# EAGLE design powermeterV2 (EAGLE 9.5.0)

## Sheet 1 of 3
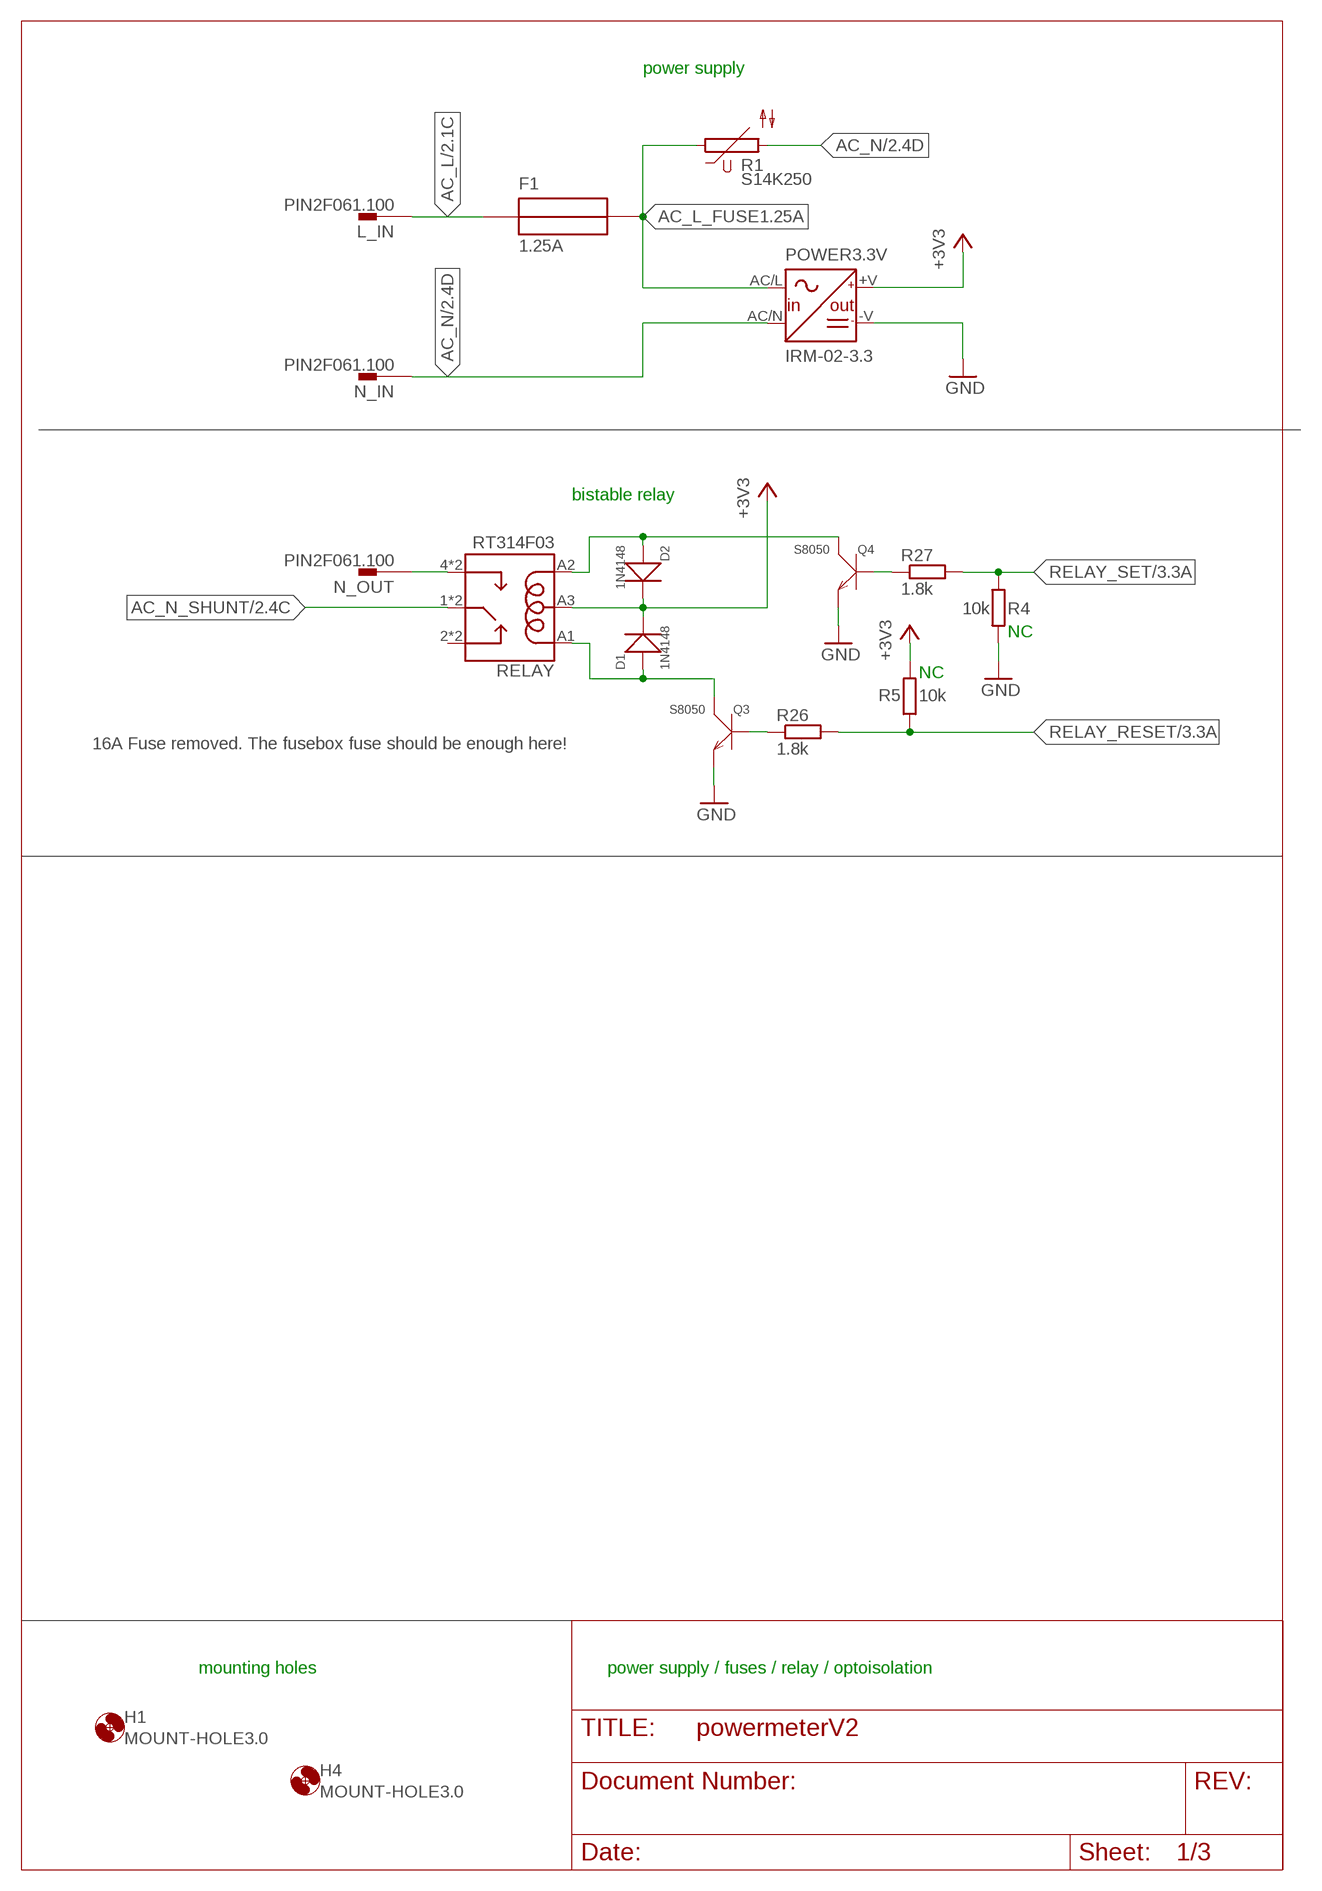
[diagram p0: schematic, sheet 1]

### Parts
D1  1N4148  SMD-DIODE-SWITCH-1N4148(LL-34)  [LL-34]
D2  1N4148  SMD-DIODE-SWITCH-1N4148(LL-34)  [LL-34]
F1  1.25A  UMT250  [SMD_FUSE]
H1  MOUNT-HOLE3.0  [3,0]
H4  MOUNT-HOLE3.0  [3,0]
L_IN  PIN2F061.100  [F061.100]
N_IN  PIN2F061.100  [F061.100]
N_OUT  PIN2F061.100  [F061.100]
POWER3.3V  IRM-02-3.3  [MW_IRM-02]
Q3  S8050  SMD-TRANSISTORS-NPN-25V-500MW-S8050(SOT-23)  [SOT-23]
Q4  S8050  SMD-TRANSISTORS-NPN-25V-500MW-S8050(SOT-23)  [SOT-23]
R1  S14K250  [S14K250]
R4  10k  R-EU_R0402  [R0402]
R5  10k  R-EU_R0402  [R0402]
R26  1.8k  R-EU_R0402  [R0402]
R27  1.8k  R-EU_R0402  [R0402]
RELAY  RT314F03  [RELAY_RT314F03]

### Nets
+3V3: D1.C(-) D2.C(-) POWER3.3V.+V(+V_OUT) R5.2 RELAY.A3 ; also sheet 2,3
AC_L: F1.P$1 L_IN.A1 L_IN.A2 ; also sheet 2
AC_L_FUSE1.25A: F1.P$2 POWER3.3V.AC/L(L) R1.1
AC_N: N_IN.A1 N_IN.A2 POWER3.3V.AC/N(N) R1.2 ; also sheet 2
AC_N_SHUNT: RELAY.1 RELAY.11 ; also sheet 2
GND: POWER3.3V.-V(-V_OUT) Q3.2(E) Q4.2(E) R4.2 ; also sheet 2,3
N$4: N_OUT.A1 N_OUT.A2 RELAY.4 RELAY.14
N$12: Q3.1(B) R26.1
N$17: D1.A(+) Q3.3(C) RELAY.A1
N$27: Q4.1(B) R27.1
N$28: D2.A(+) Q4.3(C) RELAY.A2
RELAY_RESET: R5.1 R26.2 ; also sheet 3
RELAY_SET: R4.1 R27.2 ; also sheet 3
Unconnected: RELAY.2 RELAY.12

### Notes on the sheet
- power supply
- bistable relay
- NC
- NC
- 16A Fuse removed. The fusebox fuse should be enough here!
- mounting holes | power supply / fuses / relay / optoisolation

## Sheet 2 of 3
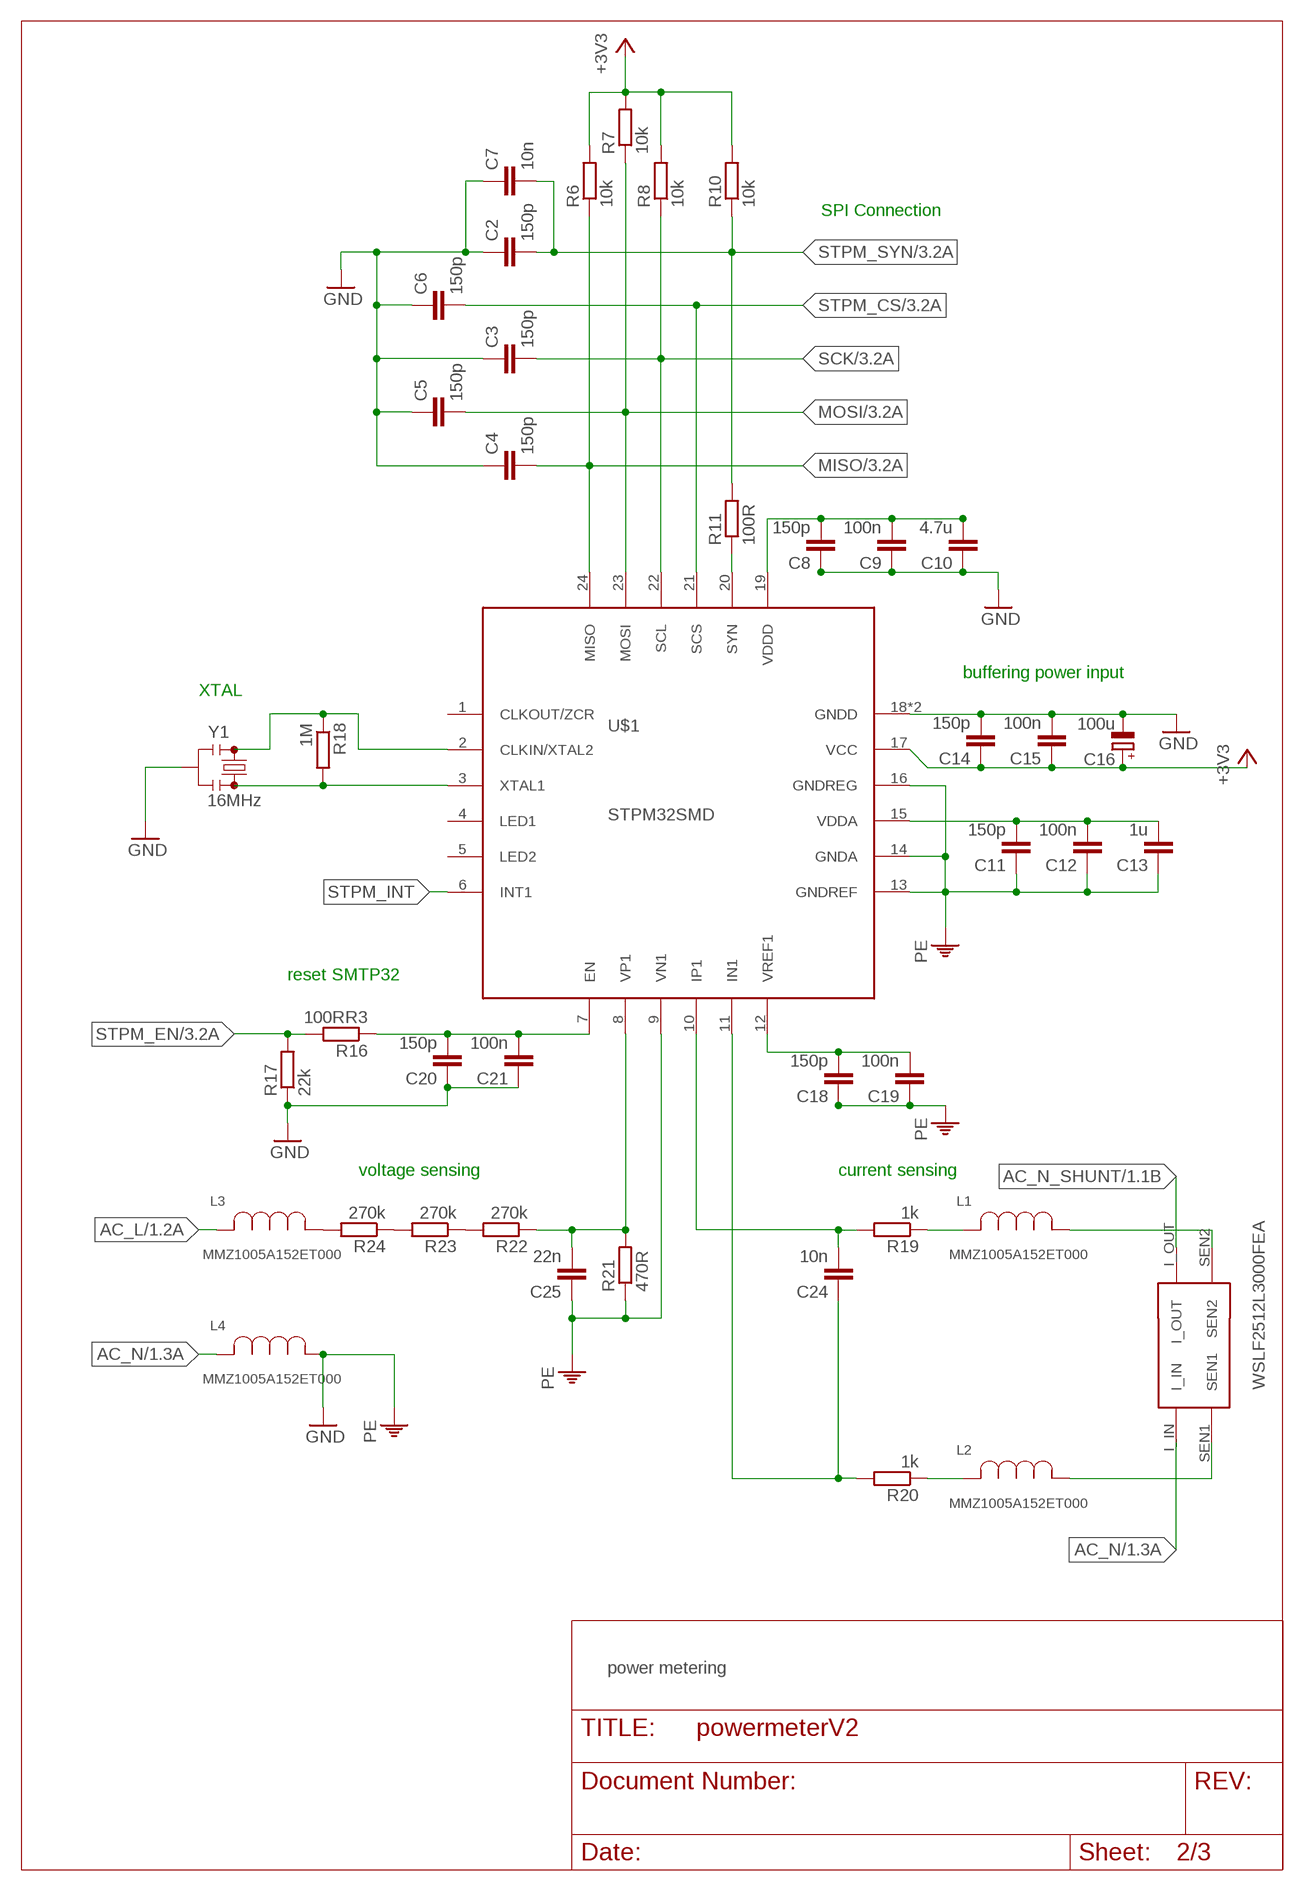
[diagram p1: schematic, sheet 2]

### Parts
C2  150p  C-EUC0402  [C0402]
C3  150p  C-EUC0402  [C0402]
C4  150p  C-EUC0402  [C0402]
C5  150p  C-EUC0402  [C0402]
C6  150p  C-EUC0402  [C0402]
C7  10n  C-EUC0603  [C0603]
C8  150p  C-EUC0402  [C0402]
C9  100n  C-EUC0603  [C0603]
C10  4.7u  C-EUC0805  [C0805]
C11  150p  C-EUC0402  [C0402]
C12  100n  C-EUC0603  [C0603]
C13  1u  C-EUC0603  [C0603]
C14  150p  C-EUC0402  [C0402]
C15  100n  C-EUC0603  [C0603]
C16  100u  CPOL-EUD/7343-31W  [D/7343-31W]
C18  150p  C-EUC0402  [C0402]
C19  100n  C-EUC0603  [C0603]
C20  150p  C-EUC0402  [C0402]
C21  100n  C-EUC0603  [C0603]
C24  10n  C-EUC0603  [C0603]
C25  22n  C-EUC0603  [C0603]
L1  MMZ1005A152ET000  [IND_1005]
L2  MMZ1005A152ET000  [IND_1005]
L3  MMZ1005A152ET000  [IND_1005]
L4  MMZ1005A152ET000  [IND_1005]
R6  10k  R-EU_R0603  [R0603]
R7  10k  R-EU_R0603  [R0603]
R8  10k  R-EU_R0603  [R0603]
R10  10k  R-EU_R0603  [R0603]
R11  100R  R-EU_R0603  [R0603]
R16  100RR3  R-EU_R0603  [R0603]
R17  22k  R-EU_R0603  [R0603]
R18  1M  R-EU_R0603  [R0603]
R19  1k  R-EU_R0603  [R0603]
R20  1k  R-EU_R0603  [R0603]
R21  470R  R-EU_M1206  [M1206]
R22  270k  R-EU_M1206  [M1206]
R23  270k  R-EU_M1206  [M1206]
R24  270k  R-EU_M1206  [M1206]
SHUNT  WSLF2512L3000FEA  [SMD_SHUNT]
U$1  STPM32SMD  [QFN24]
Y1  16MHz  RESONATORSMD-3.2X1.3  [RESONATOR-SMD-3.2X1.3]

### Nets
+3V3: C14.1 C15.1 C16.+ R6.2 R7.2 R8.2 R10.2 U$1.17(VCC) ; also sheet 1,3
AC_L: L3.2 ; also sheet 1
AC_N: L4.2 SHUNT.I_IN ; also sheet 1
AC_N_SHUNT: SHUNT.I_OUT ; also sheet 1
DC_GND1: C18.2 C19.2 U$1.12(VREF1)
DC_GND2: C20.2 C21.2 R16.1 U$1.7(EN)
GND: C2.1 C3.1 C4.1 C5.1 C6.1 C7.1 C8.1 C9.1 C10.1 C11.1 C12.1 C13.1 C14.2 C15.2 C16.- C18.1 C19.1 C20.1 C21.1 C25.1 L4.1 R17.1 R21.1 U$1.9(VN1) U$1.13(GNDREF) U$1.14(GNDA) U$1.16(GNDREG) U$1.18(GNDD) U$1.EXP(GNDD) Y1.2 ; supply symbol labelled PE ; also sheet 1,3
MISO: C4.2 R6.1 U$1.24(MISO) ; also sheet 3
MOSI: C5.2 R7.1 U$1.23(MOSI) ; also sheet 3
N$3: C8.2 C9.2 C10.2 U$1.19(VDDD)
N$6: C11.2 C12.2 C13.2 U$1.15(VDDA)
N$7: R18.2 U$1.3(XTAL1) Y1.3
N$8: R18.1 U$1.2(CLKIN/XTAL2) Y1.1
N$9: C24.1 R20.2 U$1.11(IN1)
N$10: R11.1 U$1.20(SYN)
N$11: C24.2 R19.2 U$1.10(IP1)
N$13: C25.2 R21.2 R22.1 U$1.8(VP1)
N$14: R23.2 R24.1
N$15: R22.2 R23.1
N$19: L3.1 R24.2
N$21: L1.2 R19.1
N$22: L2.2 R20.1
N$24: L1.1 SHUNT.SEN2
N$25: L2.1 SHUNT.SEN1
SCK: C3.2 R8.1 U$1.22(SCL) ; also sheet 3
STPM_CS: C6.2 U$1.21(SCS) ; also sheet 3
STPM_EN: R16.2 R17.2 ; also sheet 3
STPM_INT: U$1.6(INT1)
STPM_SYN: C2.2 C7.2 R10.1 R11.2 ; also sheet 3
Unconnected: U$1.1(CLKOUT/ZCR) U$1.4(LED1) U$1.5(LED2)

### Notes on the sheet
- SPI Connection
- buffering power input
- XTAL
- reset SMTP32
- voltage sensing | current sensing
- power metering

## Sheet 3 of 3
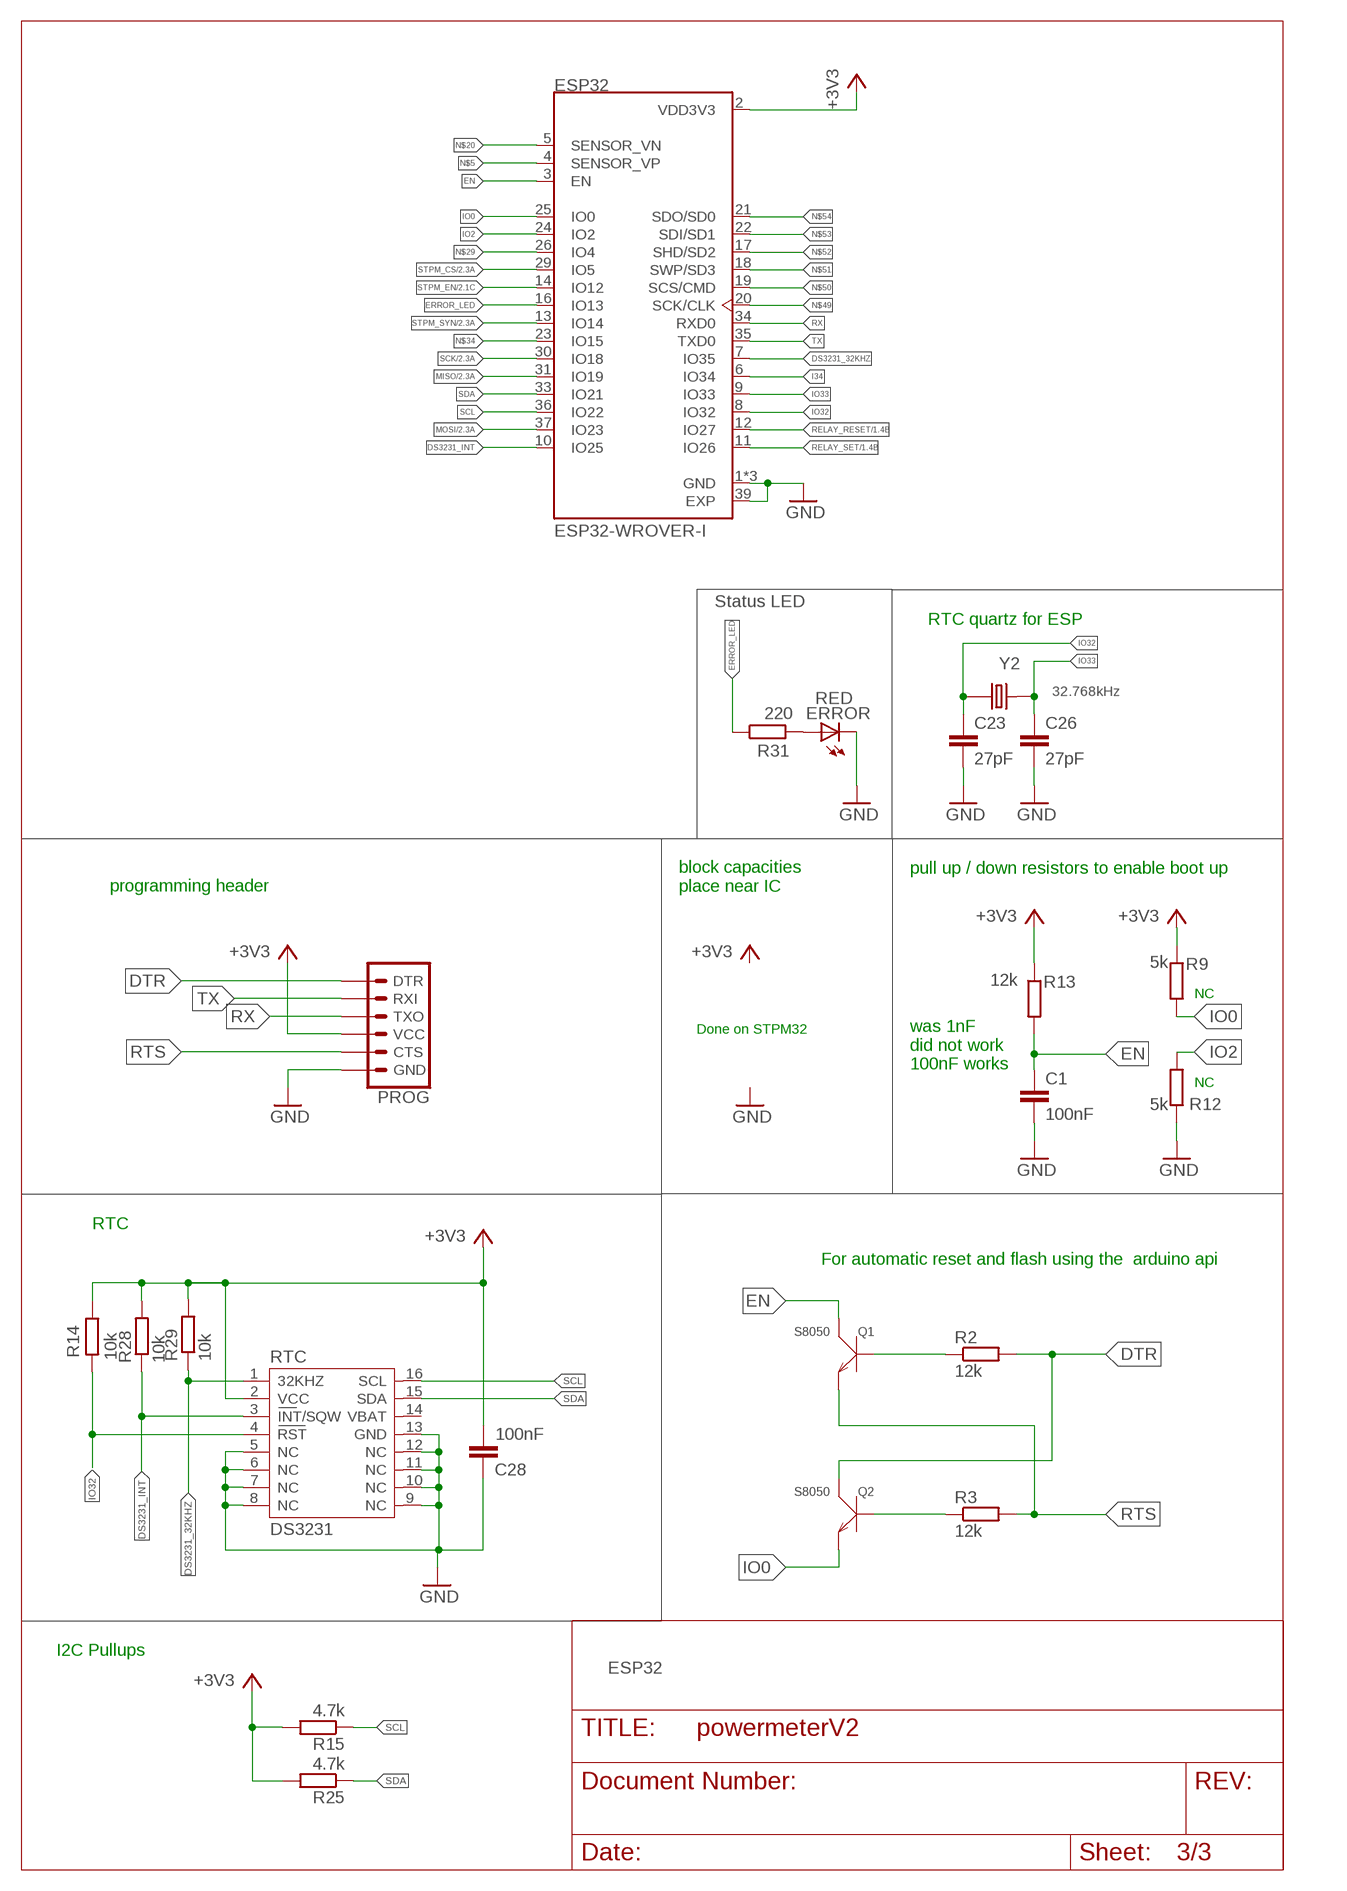
[diagram p2: schematic, sheet 3]

### Parts
C1  100nF  C-EUC0402  [C0402]
C23  27pF  C-EUC0402  [C0402]
C26  27pF  C-EUC0402  [C0402]
C28  100nF  C-EUC0402  [C0402]
ERROR  RED  LEDCHIP-LED0805  [CHIP-LED0805]
ESP32  ESP32-WROVER-I  [XCVR_ESP32-WROVER-I]
PROG  6_PIN_SERIAL_TARGET  [1X06]
Q1  S8050  SMD-TRANSISTORS-NPN-25V-500MW-S8050(SOT-23)  [SOT-23]
Q2  S8050  SMD-TRANSISTORS-NPN-25V-500MW-S8050(SOT-23)  [SOT-23]
R2  12k  R-EU_R0402  [R0402]
R3  12k  R-EU_R0402  [R0402]
R9  5k  R-EU_R0402  [R0402]
R12  5k  R-EU_R0402  [R0402]
R13  12k  R-EU_R0402  [R0402]
R14  10k  R-EU_R0603  [R0603]
R15  4.7k  R-EU_R0603  [R0603]
R25  4.7k  R-EU_R0603  [R0603]
R28  10k  R-EU_R0603  [R0603]
R29  10k  R-EU_R0603  [R0603]
R31  220  R-EU_R0603  [R0603]
RTC  DS3231  [DS3231]
Y2  NX2012SA-32.768K-STD-MUB-1  [XTAL_NX2012SA-32.768K-STD-MUB-1]

### Nets
+3V3: C28.2 ESP32.2(VDD3V3) PROG.4(VCC) R9.1 R13.1 R14.1 R15.2 R25.2 R28.2 R29.2 RTC.2(VCC) ; also sheet 1,2
DS3231_32KHZ: ESP32.7(IO35) R29.1 RTC.1(32KHZ)
DS3231_INT: ESP32.10(IO25) R28.1 RTC.3(INT/SQW)
DTR: PROG.1(DTR) Q2.3(C) R2.2
EN: C1.1 ESP32.3(EN) Q1.3(C) R13.2
ERROR_LED: ESP32.16(IO13) R31.1
GND: C1.2 C23.2 C26.2 C28.1 ERROR.C ESP32.1(GND) ESP32.15(GND) ESP32.38(GND) ESP32.39(EXP) PROG.6(GND) R12.1 RTC.5(NC) RTC.6(NC) RTC.7(NC) RTC.8(NC) RTC.9(NC) RTC.10(NC) RTC.11(NC) RTC.12(NC) RTC.13(GND) ; also sheet 1,2
I34: ESP32.6(IO34)
IO0: ESP32.25(IO0) Q2.2(E) R9.2
IO2: ESP32.24(IO2) R12.2
IO32: C23.1 ESP32.8(IO32) R14.2 RTC.4(RST) Y2.1
IO33: C26.1 ESP32.9(IO33) Y2.2
MISO: ESP32.31(IO19) ; also sheet 2
MOSI: ESP32.37(IO23) ; also sheet 2
N$1: Q1.1(B) R2.1
N$2: Q2.1(B) R3.1
N$5: ESP32.4(SENSOR_VP)
N$16: ERROR.A R31.2
N$20: ESP32.5(SENSOR_VN)
N$29: ESP32.26(IO4)
N$34: ESP32.23(IO15)
N$49: ESP32.20(SCK/CLK)
N$50: ESP32.19(SCS/CMD)
N$51: ESP32.18(SWP/SD3)
N$52: ESP32.17(SHD/SD2)
N$53: ESP32.22(SDI/SD1)
N$54: ESP32.21(SDO/SD0)
RELAY_RESET: ESP32.12(IO27) ; also sheet 1
RELAY_SET: ESP32.11(IO26) ; also sheet 1
RTS: PROG.5(CTS) Q1.2(E) R3.2
RX: ESP32.34(RXD0) PROG.3(TXO)
SCK: ESP32.30(IO18) ; also sheet 2
SCL: ESP32.36(IO22) R15.1 RTC.16(SCL)
SDA: ESP32.33(IO21) R25.1 RTC.15(SDA)
STPM_CS: ESP32.29(IO5) ; also sheet 2
STPM_EN: ESP32.14(IO12) ; also sheet 2
STPM_SYN: ESP32.13(IO14) ; also sheet 2
TX: ESP32.35(TXD0) PROG.2(RXI)
Unconnected: RTC.14(VBAT)

### Notes on the sheet
- Status LED
- RTC quartz for ESP
- 32.768kHz
- pull up / down resistors to enable boot up
- programming header
- block capacities
  place near IC
- NC
- Done on STPM32
- was 1nF
  did not work
  100nF works
- NC
- RTC
- For automatic reset and flash using the  arduino api
- I2C Pullups
- ESP32

## Library data of the parts
C1-C15 C18-C21 C23-C26 C28 = rcl:C-EU: CAPACITOR, European symbol; SPICEPREFIX: C
C16 = rcl:CPOL-EU: POLARIZED CAPACITOR, European symbol; SPICEPREFIX: C
D1 D2 = Seeed-OPL-Diode:SMD-DIODE-SWITCH-1N4148(LL-34): 304040016; MPN: 1N4148
ERROR = led:LED: LED OSRAM: - CHIPLED LG R971, LG N971, LY N971, LG Q971, LY Q971, LO R971, LY R971 LH N974, LH R974 LS Q976, LO Q976, LY Q976 LO Q996 - Hyper CHIPLED LW Q18S LB Q993, LB Q99A, LB R99A - SideLED LS A670, LO A670, LY A670, LG A670, LP A670 LB A673, LV A673, LT A673, LW A673 LH A674 LY A675 LS A676, LA A676, LO A676, LY A676, LW A676 LS A679, LY A679, LG A679 - Hyper Micro SIDELED® LS Y876, LA Y876, LO Y876, LY Y876 LT Y87S - SmartLED LW L88C, LW L88S LB L89C, LB L89S, LG L890 LS L89K, LO L89K, LY L89K LS L896, LA L896, LO L896, LY L896 - TOPLED LS T670, LO T670, LY T670, LG T670, LP T670 LSG T670, LSP T670, LSY T670, LOP T670, LYG T670 LG T671, LOG T671, LSG T671 LB T673, LV T673, LT T673, LW T673 LH T674 LS T676, LA T676, LO T676, LY T676, LB T676, LH T676, LSB T676, LW T676 LB T67C, LV T67C, LT T67C, LS T67K, LO T67K, LY T67K, LW E67C LS E67B, LA E67B, LO E67B, LY E67B, LB E67C, LV E67C, LT E67C LW T67C LS T679, LY T679, LG T679 LS T770, LO T770, LY T770, LG T770, LP T770 LB T773, LV T773, LT T773, LW T773 LH T774 LS E675, LA E675, LY E675, LS T675 LS T776, LA T776, LO T776, LY T776, LB T776 LHGB T686 LT T68C, LB T68C - Hyper Mini TOPLED® LB M676 - Mini TOPLED Santana® LG M470 LS M47K, LO M47K, LY M47K Source: http://www.osram.convergy.de LUXEON: - LUMILED® LXK2-PW12-R00, LXK2-PW12-S00, LXK2-PW14-U00, LXK2-PW14-V00 LXK2-PM12-R00, LXK2-PM12-S00, LXK2-PM14-U00 LXK2-PE12-Q00, LXK2-PE12-R00, LXK2-PE12-S00, LXK2-PE14-T00, LXK2-PE14-U00 LXK2-PB12-K00, LXK2-PB12-L00, LXK2-PB12-M00, LXK2-PB14-N00, LXK2-PB14-P00, LXK2-PB14-Q00 LXK2-PR12-L00, LXK2-PR12-M00, LXK2-PR14-Q00, LXK2-PR14-R00 LXK2-PD12-Q00, LXK2-PD12-R00, LXK2-PD12-S00 LXK2-PH12-R00, LXK2-PH12-S00 LXK2-PL12-P00, LXK2-PL12-Q00, LXK2-PL12-R00 Source: www.luxeon.com KINGBRIGHT: KA-3528ASYC Source: www.kingbright.com
ESP32 = ESP32-WROVER-I:ESP32-WROVER-I: Module: combo; GPIO, I2C x2, I2S x2, SDIO, SPI x3, UART x3; U.FL; AVAILABILITY: Unavailable; DESCRIPTION: Module: combo; GPIO, I2C x2, I2S x2, SDIO, SPI x3, UART x3; U.FL; MF: Espressif Systems; MP: ESP32-WROVER-I; PACKAGE: Module Espressif Systems; PRICE: None
F1 = _powermeter:UMT250
H1 H4 = holes:MOUNT-HOLE: MOUNTING HOLE with drill center marker
L1-L4 = _powermeter:MMZ1005A152ET000; MANUFACTURER_PART_NUMBER: MMZ1005A152ET000; VENDOR: TDK
L_IN N_IN N_OUT = con-faston:PIN2: Flachstecker Typ Tyco/Electronics/AMP TAB, FASTON Printed Circuit Board Tabs Source: http://www.buerklin.com, http://catalog.tycoelectronics.com; OC_FARNELL: unknown; OC_NEWARK: unknown
POWER3.3V = reichelt_power:IRM-02: MEAN WELL AC/DC Power Modules 2W Soruce: http://meanwellusa.com/productPdf.aspx?i=675; OC_MOUSER: 709-IRM02-3.3
PROG = SparkFun-Connectors:6_PIN_SERIAL_TARGET: 6-pin header connection for use with the "FTDI BASIC" pinout - TARGET SIDE. Also known as "Arduino Serial Program Header". It is used to mate with our FTDI Basic serial programmers using the Arduino IDE. Note, this device has "TARGET" in the name. It is intended to be used on a design that contains a target micro-controller that you wish to program. The "sister" device, named "CABLE" is inteneded to be used on a design that usually lives on the end of your USB cable and prvides the converter chip (FTDI232 or FTDI231x) to commnicate serial RX/TX. You can populate with some of these: Break Away Headers - Straight <https://www.sparkfun.com/products/116> (PRT-00116) For reference (or to suit your programming needs) check out these designs: SparkFun FTDI Basic Breakout - 5V <https://www.sparkfun.com/products/9716> (DEV-09716) SparkFun FTDI Basic Breakout - 3.3V <https://www.sparkfun.com/products/9873> (DEV-09873) SparkFun FTDI SmartBasic <https://www.sparkfun.com/products/12935> (DEV-12935) SparkFun Beefy 3 - FTDI Basic Breakout <https://www.sparkfun.com/products/13746> (DEV-13746)
Q1-Q4 = Seeed-Transistor:SMD-TRANSISTORS-NPN-25V-500MW-S8050(SOT-23): 305010017; MPN: S8050
R1 = varistor:S14K250: VARISTOR
R2-R29 R31 = resistor:R-EU_: RESISTOR, European symbol
RELAY = RT314F03:RT314F03: Electromechanical Relay 3VDC 15Ohm 16A SPDT (( 29mm 12.7mm 15.7mm)) THT Power Relay; AVAILABILITY: Unavailable; DESCRIPTION: Power Relay 3VDC 16A SPDT __ 29mm 12.7mm 15.7mm__ Through Hole; MF: TE Connectivity; MP: RT314F03; PACKAGE: None; PRICE: None; TE_PURCHASE_URL: https://www.te.com/usa-en/product-RT314F03.html?te_bu=Cor&te_type=disp&te_campaign=seda_glo_cor-seda-global-disp-prtnr-fy19-seda-model-bom-cta_sma-317_1&elqCampaignId=32493
RTC = _lh-library:DS3231
SHUNT = _powermeter:WSLF2512L3000FEA
U$1 = _powermeter:STPM32
Y1 = SparkFun-Clocks:RESONATOR: Resonators (Generic) Ceramic resonators are clock-generating components, often used to control timing in microcontrollers. They usually have 3 pins: two pins for oscillation, and one pin for ground. Compared to crystals, resonators have worse tolerance, but are usually much cheaper. Plus, they have built-in load capacitors! These devices are used on boards like the Arduino Pro 8MHz <https://www.sparkfun.com/products/11114> and Arduino Pro 16MHz <https://www.sparkfun.com/products/11113>.
Y2 = NX2012SA-32.768K-STD-MUB-1:NX2012SA-32.768K-STD-MUB-1: Crystal 32.7680khz 12.5pf Smd; AVAILABILITY: Unavailable; DESCRIPTION: Crystal 32.7680khz 12.5pf Smd; MF: NDK America,; MP: NX2012SA-32.768K-STD-MUB-1; PACKAGE: SMD-2 NDK; PRICE: None

## Board
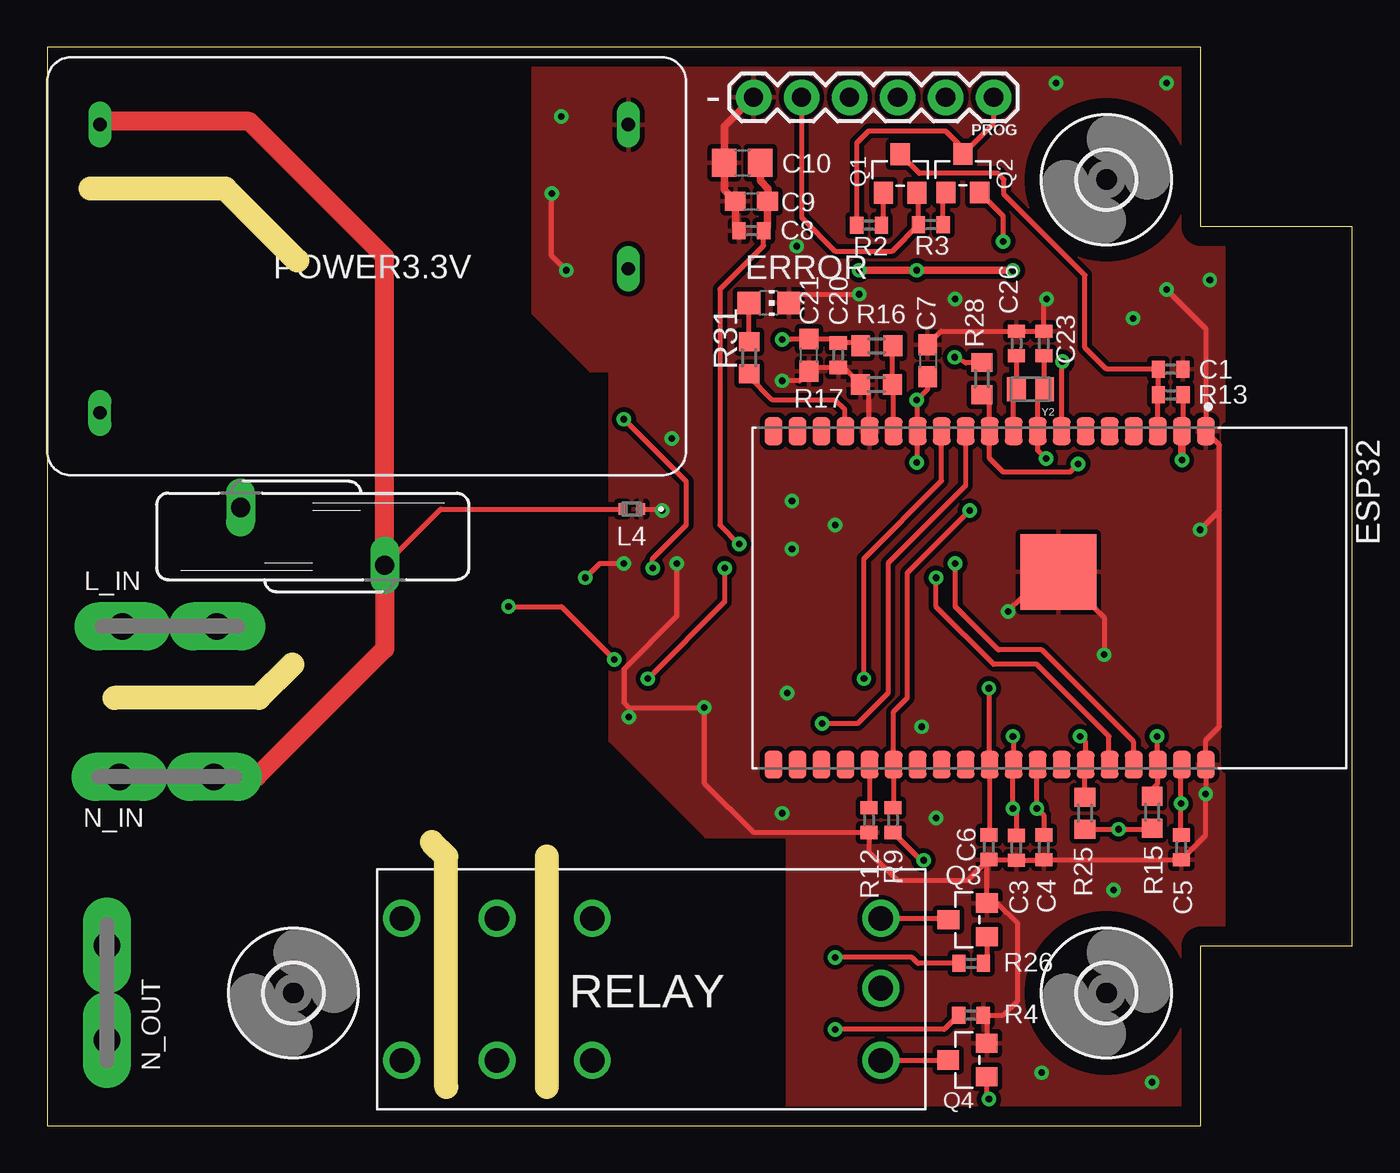
[diagram p3: board, top side]
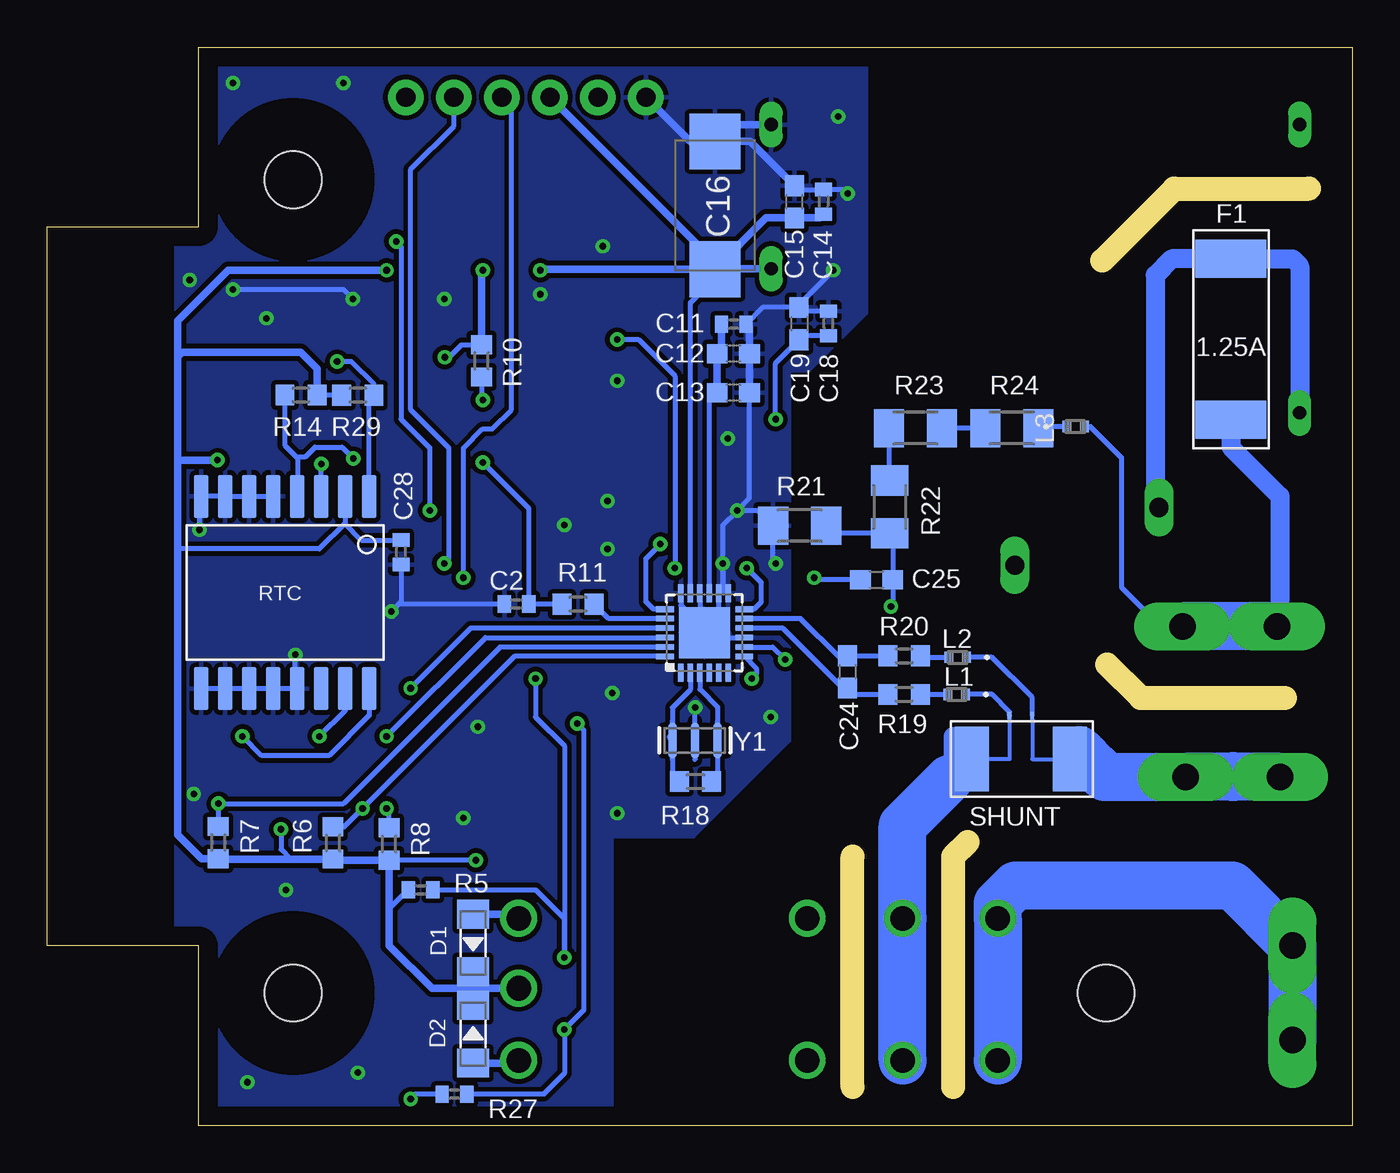
[diagram p4: board, bottom side, seen from below]

Size 69 x 57 mm. Coordinates in mm from the lower left corner, seen from the top.
Outline: 0,0 61,0 61,9.5 69,9.5 69,47.5 61,47.5 61,57 0,57 0,0
Copper layers (1*16): Top 0.035mm / dielectric 1.5mm / Bottom 0.035mm
Design rules "default": minimum track width 6mil, minimum drill 0.35mm, track to track 6mil, track to pad 6mil, pad to pad 6mil, via to via 6mil, smd to smd 6mil, copper to edge 40mil, drill to drill 6mil, minimum pad ring 10mil, minimum via ring 8mil, stop-mask expansion 4mil, vias tented up to drill 0mil, thermal gap 10mil
Milling: 7 lines

### Footprints (pad centres in the part's own frame; a part is rotated, then mirrored left to right if it is on the bottom)
C0402 = smd 0.7 x 0.9: 1 -0.65,0; 2 0.65,0
C0603 = smd 1.1 x 1: 1 -0.85,0; 2 0.85,0
C0805 = smd 1.3 x 1.5: 1 -0.95,0; 2 0.95,0
D/7343-31W = smd 2.95 x 2.7: + 3.375,0; - -3.375,0
LL-34 = smd 1.524 x 1.676: A -1.524,0; C 1.524,0
CHIP-LED0805 = smd 1.2 x 1.2: A 0,-1.05; C 0,1.05
XCVR_ESP32-WROVER-I = smd 1.45 x 0.93: 1 -8.81,8.26; 2 -8.81,6.99; 3 -8.81,5.72; 4 -8.81,4.45; 5 -8.81,3.18; 6 -8.81,1.91; 7 -8.81,0.64; 8 -8.81,-0.63; 9 -8.81,-1.9; 10 -8.81,-3.17; 11 -8.81,-4.44; 12 -8.81,-5.71; 13 -8.81,-6.98; 14 -8.81,-8.25; 15 -8.81,-9.52; 16 -8.81,-10.79; 17 -8.81,-12.06; 18 -8.81,-13.33; 19 -8.81,-14.6; 20 8.81,-14.6; 21 8.81,-13.33; 22 8.81,-12.06; 23 8.81,-10.79; 24 8.81,-9.52; 25 8.81,-8.25; 26 8.81,-6.98; 27 8.81,-5.71; 28 8.81,-4.44; 29 8.81,-3.17; 30 8.81,-1.9; 31 8.81,-0.63; 32 8.81,0.64; 33 8.81,1.91; 34 8.81,3.18; 35 8.81,4.45; 36 8.81,5.72; 37 8.81,6.99; 38 8.81,8.26 | smd 4 x 4: 39 -1.38,0.47
SMD_FUSE = smd 2 x 3.75: P$1 -8.5,0; P$2 0,0
3,0 = hole 3: 0,0
IND_1005 = smd 0.423 x 0.6: 1 -0.492,0; 2 0.492,0
F061.100 = drill 1.4 pad 2.54 long: A1 -2.5,0; A2 2.5,0
MW_IRM-02 = drill 0.7 long: +V 13.97,0; -V 13.97,7.62; AC/L -13.97,-7.62; AC/N -13.97,7.62
1X06 = drill 1.016 pad 1.88: 1 0,0; 2 2.54,0; 3 5.08,0; 4 7.62,0; 5 10.16,0; 6 12.7,0
SOT-23 = smd 1.016 x 1.143: 1 -0.889,-1.016; 2 0.889,-1.016; 3 0,1.016
S14K250 = drill 1.016 long: 1 -1.524,-3.81; 2 1.524,3.81
R0402 = smd 0.7 x 0.9: 1 -0.65,0; 2 0.65,0
R0603 = smd 1 x 1.1: 1 -0.85,0; 2 0.85,0
M1206 = smd 1.6 x 2: 1 -1.4,0; 2 1.4,0
RELAY_RT314F03 = drill 1.3: 1 7.62,3.75; 2 2.58,3.75; 4 12.66,3.75; 11 7.62,-3.75; 12 2.58,-3.75; 14 12.66,-3.75; A1 -12.68,-3.75; A2 -12.68,3.75; A3 -12.68,-0.06
DS3231 = smd 0.762 x 2.286: 1 -4.445,-5.08; 2 -3.175,-5.08; 3 -1.905,-5.08; 4 -0.635,-5.08; 5 0.635,-5.08; 6 1.905,-5.08; 7 3.175,-5.08; 8 4.445,-5.08; 9 4.445,5.08; 10 3.175,5.08; 11 1.905,5.08; 12 0.635,5.08; 13 -0.635,5.08; 14 -1.905,5.08; 15 -3.175,5.08; 16 -4.445,5.08
SMD_SHUNT = smd 1.8 x 3.4: I_IN 0.2,0; I_OUT 5.4,0 | smd 0.203 x 0.406: SEN1 2.2,-2.3; SEN2 3.4,-2.3
QFN24 = smd 0.95 x 0.3: 1 -2.1,1.25; 2 -2.1,0.75; 3 -2.1,0.25; 4 -2.1,-0.25; 5 -2.1,-0.75; 6 -2.1,-1.25; 13 2.1,-1.25; 14 2.1,-0.75; 15 2.1,-0.25; 16 2.1,0.25; 17 2.1,0.75; 18 2.1,1.25 | smd 0.3 x 0.95: 7 -1.25,-2.1; 8 -0.75,-2.1; 9 -0.25,-2.1; 10 0.25,-2.1; 11 0.75,-2.1; 12 1.25,-2.1; 19 1.25,2.1; 20 0.75,2.1; 21 0.25,2.1; 22 -0.25,2.1; 23 -0.75,2.1; 24 -1.25,2.1 | smd 2.7 x 2.7: EXP 0,0
RESONATOR-SMD-3.2X1.3 = smd 0.45 x 1.905: 1 -1.2,0; 2 0,0; 3 1.2,0
XTAL_NX2012SA-32.768K-STD-MUB-1 = smd 1 x 1.25: 1 -0.75,0; 2 0.75,0

### Placement (x,y rotation side)
C1  59.4,39.99 0 top
C2  44.18,27.57 0 bottom
C3  51.24,14.68 90 top
C4  52.69,14.7 90 top
C5  59.96,14.7 90 top
C6  49.78,14.71 90 top
C7  46.55,40.43 270 top
C8  37.22,47.31 0 top
C9  37.22,48.86 0 top
C10  36.74,50.9 0 top
C11  32.7,42.37 180 bottom
C12  32.72,40.81 180 bottom
C13  32.72,38.74 180 bottom
C14  27.95,48.83 90 bottom
C15  29.49,48.83 90 bottom
C16  33.69,48.65 270 bottom
C18  27.7,42.4 270 bottom
C19  29.24,42.4 270 bottom
C20  41.82,40.72 90 top
C21  40.28,40.73 90 top
C23  52.69,41.34 90 top
C24  26.68,23.98 270 bottom
C25  25.14,28.85 0 bottom
C26  51.24,41.34 90 top
C28  50.29,30.3 90 bottom
D1  46.48,9.65 270 bottom
D2  46.48,4.83 90 bottom
ERROR  38.15,43.48 270 top
ESP32  52.99,27.89 270 top
F1  6.4,45.82 90 bottom
H1  56,50 0 top
H2  MOUNT-HOLE3.0  [3,0]  56,7 0 top
H4  13,7 0 top
L1  20.91,22.79 180 bottom
L2  20.86,24.75 180 bottom
L3  14.63,36.95 0 bottom
L4  30.9,32.59 180 top
L_IN  6.47,26.39 180 top
N_IN  6.3,18.43 180 top
N_OUT  3.15,7.02 90 top
POWER3.3V  16.75,45.29 0 top
PROG  50.04,54.36 180 top
Q1  45.1,50.33 0 top
Q2  48.41,50.35 0 top
Q3  48.66,10.87 90 top
Q4  48.65,3.46 90 top
R1  14.02,31.14 270 top
R2  43.45,47.6 180 top
R3  46.71,47.62 180 top
R4  48.83,5.83 0 top
R5  49.26,12.45 180 bottom
R6  53.89,14.94 270 bottom
R7  59.96,14.96 270 bottom
R8  50.92,14.88 270 bottom
R9  44.72,16.14 90 top
R10  46.04,40.42 90 bottom
R11  40.93,27.56 180 bottom
R12  43.45,16.14 90 top
R13  59.4,38.63 180 top
R14  55.59,38.62 180 bottom
R15  58.42,16.56 270 top
R16  43.86,41.22 0 top
R17  43.84,39.17 0 top
R18  34.72,18.18 0 bottom
R19  23.68,22.79 180 bottom
R20  23.68,24.83 180 bottom
R21  29.21,31.71 0 bottom
R22  24.45,32.7 90 bottom
R23  23.09,36.87 0 bottom
R24  17.98,36.87 0 bottom
R25  54.86,16.51 270 top
R26  48.84,8.57 180 top
R27  47.47,1.65 0 bottom
R28  49.42,39.49 90 top
R29  52.58,38.61 180 bottom
R31  37.11,40.59 90 top
RELAY  31.39,7.2 180 top
RTC  56.42,28.18 180 bottom
SHUNT  14.71,19.37 180 bottom
U$1  34.24,26.05 90 bottom
Y1  34.75,20.36 0 bottom
Y2  51.98,38.92 180 top

### Tracks (layer width: path | path; a pad name or v marks a point on that pad's centre or on a via)
+3V3  (via drill 0.35)
  Top 0.254: R9.1 46.19,14.02 v46.33,14.02 | R28.2 48.66,40.34 48.55,40.32 48.04,40.62 v47.98,40.62 | R13.1 60.05,36.77 ESP32.2 | R25.2 v56.64,15.66 58.37,15.66 R15.2
  Top 0.406: v42.93,45.21 v45.97,45.21 v51.05,45.21 | ESP32.2 v59.98,35.19 v59.99,35.18
  Bottom 0.254: 53.84,14.03 R6.2 | 59.94,14.09 R7.2 | U$1.17 34.99,43.49 33.27,45.21 33.27,45.29 | v46.33,14.02 R8.2 | v47.98,40.62 47.75,40.62 47.09,41.27 R10.2 | R29.2 R14.1 | v56.64,15.66 56.64,14.6 56.13,14.09 | R5.2 50.91,11.45 | C28.2 52.39,30.95 53.24,31.81 | RTC.2 53.24,31.81 | 53.24,31.81 53.28,31.81 54.61,30.48 62.1,30.48
  Bottom 0.406: POWER3.3V.+V 33.27,45.29 33.67,45.29 C16.+ | C14.1 28.15,47.98 C15.1 30.98,47.98 C16.+ | PROG.4 33.69,45.63 C16.+ | C16.+ 42.87,45.27 v42.93,45.21 | v45.97,45.21 46.04,45.15 R10.2 | v51.05,45.21 59.44,45.21 62.1,42.55 62.1,40.64 | R8.2 50.91,11.45 50.91,9.51 48.66,7.26 46.48,7.26 | R8.2 53.84,14.03 | R6.2 56.13,14.09 59.94,14.09 | R7.2 60.84,14.11 62.1,15.37 62.1,30.48 62.1,35.05 | 62.1,40.64 62.1,35.05 | R14.1 54.74,40 55.6,40.87 61.87,40.87 62.1,40.64 | v59.99,35.18 61.98,35.18 62.1,35.05 | 46.48,7.26 RELAY.A3 | 46.48,7.26 D1.C D2.C
AC_L
  Bottom 0.254: L3.2 13.84,36.95 12.19,35.31 12.19,28.45 10.13,26.39 L_IN.A1
  Bottom 1.016: F1.P$1 6.4,35.86 3.81,33.27 3.81,26.55 L_IN.A2
  Bottom 2.54: L_IN.A2 L_IN.A1
AC_L_FUSE1.25A
  Bottom 1.016: POWER3.3V.AC/L 2.78,45.45 3.14,45.82 F1.P$2 9.56,45.82 10.41,44.96 10.41,32.87 R1.1
AC_N
  Top 0.254: R1.2 20.8,32.59 L4.2
  Top 1.016: POWER3.3V.AC/N 2.95,53.09 10.67,53.09 17.83,45.92 R1.2 17.83,25.2 11.07,18.43 N_IN.A1
  Bottom 0.813: SHUNT.I_IN 14.43,19.86 | 14.05,19.48 14.05,19.94
  Bottom 2.54: N_IN.A2 6.26,18.43 6.3,18.47 6.34,18.43 N_IN.A1 13.1,18.43 13.21,18.54 13.21,18.64 14.05,19.48 14.43,19.86
AC_N_SHUNT
  Bottom 1.016: SHUNT.I_OUT 21.08,20.34 | 21.08,20.34 21.08,20.57 | 21.31,18.31 21.08,18.54 21.08,20.34
  Bottom 2.54: RELAY.1 RELAY.11 23.77,15.85 21.31,18.31
DC_GND1  (via drill 0.35)
  Top 0.254: v32,29.46 32,29.97 33.78,31.75 33.78,34.04 v30.48,37.34
  Bottom 0.254: C18.2 29.04,41.74 29.17,41.62 C19.2 30.48,40.31 v30.48,37.34 | U$1.12 31.63,27.3 31.24,27.69 31.24,28.7 v32,29.46
DC_GND2  (via drill 0.35)
  Top 0.254: R16.1 42.85,41.37 C20.2 41.61,41.58 C21.2 39.29,41.58 39.27,41.55 v38.86,41.55 | v35.81,29.46 35.81,27.69 v31.75,23.62
  Bottom 0.254: U$1.7 31.5,24.15 31.5,23.88 v31.75,23.62 | v38.86,41.55 37.74,41.55 35.81,39.62 v35.81,29.46
DS3231_32KHZ  (via drill 0.35)
  Top 0.254: ESP32.7 53.63,40.35 v53.67,40.39
  Bottom 0.254: RTC.1 51.98,38.36 R29.1 51.73,39.2 52.92,40.4 v53.66,40.4 v53.67,40.39
DS3231_INT  (via drill 0.35)
  Top 0.254: v54.51,34.98 54.08,34.54 50.55,34.54 49.82,35.27 ESP32.10 49.82,38.23 R28.1
  Bottom 0.254: RTC.3 v54.52,34.97 v54.51,34.98
DTR
  Top 0.254: Q2.3 48.56,51.52 | 48.56,51.52 50.04,52.99 PROG.1 | R2.2 42.8,51.94 43.43,52.58 47.5,52.58 48.56,51.52
EN
  Top 0.254: ESP32.3 58.71,38.63 R13.2 C1.1 56.01,39.98 56,39.98 54.86,41.12 54.86,44.96 50.59,49.23 50.59,50.02 50.28,50.33 46.11,50.33 Q1.3
ERROR_LED
  Top 0.254: ESP32.16 42.16,36.74 42.16,37.85 41.66,38.35 38.35,38.35 37.11,39.6 R31.1
GND  (via drill 0.35)
  Top 0.254: 61.98,32.51 61.98,21.08 61.25,20.36 ESP32.38 v61.25,17.53 61.25,15.35 C5.1 C4.1 52.66,14.03 C3.1 51.21,14.06 C6.1 49.68,13.96 | 61.98,32.51 61.98,35.98 ESP32.1 61.25,42.12 v59.18,44.2 | L4.1 32.44,32.59 v32.51,32.51 | 49.68,13.96 Q3.2 50.22,11.76 51.31,10.67 51.31,6.6 50.54,5.83 R4.2 49.67,5.65 Q4.2 | C7.1 47.26,41.99 C26.2 C23.2 52.69,43.55 v52.83,43.69 | v28.45,28.96 29.21,29.72 v30.48,29.72 | 49.68,13.96 48.67,12.95 44.96,12.95 43.45,14.46 R12.1 37.34,15.49 34.73,18.11 v34.73,22.1 v34.72,22.1 30.73,22.1 30.48,22.35 30.48,24.13 33.27,26.92 v33.27,29.72 | v55.88,24.89 55.88,26.85 ESP32.39 52.13,27.94 51.56,27.94 v50.8,27.18 | v27.43,45.21 26.67,45.97 v26.67,49.28 | ESP32.15 43.43,36.74 43.43,38.73 R17.1 42.09,40.07 C20.1 40.47,40.07 C21.1 39.77,39.37 v38.86,39.37 | v60.96,31.5 61.98,32.51 | ERROR.C 39.66,43.94 v42.93,43.94
  Top 0.406: C8.1 36.38,47.51 C9.1 35.8,49.44 C10.1 35.8,52.81 PROG.6
  Bottom 0.254: RTC.9 RTC.10 RTC.11 RTC.12 RTC.13 55.88,23.19 v55.88,24.89 | RTC.5 RTC.6 RTC.7 RTC.8 60.96,33.16 v60.96,31.5 | Y1.2 34.75,22.08 v34.73,22.1 | 34.07,25.87 U$1.EXP 34.04,26.05 | 34.07,25.87 33.99,25.8 U$1.9 | U$1.16 34.49,26.87 34.07,26.45 34.07,25.87 | U$1.14 33.49,26.63 33.27,26.42 33.64,26.05 34.04,26.05 | U$1.13 33.27,28.15 | 33.27,28.15 U$1.14 | U$1.18 35.49,27.5 34.04,26.05 | C15.2 29.29,49.48 C14.2 26.87,49.48 v26.67,49.28 | v32.51,32.51 33.27,31.75 v33.27,29.72 | v33.27,29.72 33.27,28.15 | v32.51,32.51 31.87,33.15 C13.1 | C18.1 29.04,43.05 C19.1 | C19.1 31.17,43.24 C11.1 | v32.51,32.51 31.41,32.51 R21.1 30.61,29.85 v30.48,29.72 | C25.1 28.34,28.85 v28.45,28.96 | C2.1 50.41,27.57 v50.8,27.18 50.29,27.69 C28.1 | C19.1 29.24,43.4 v27.43,45.21 | U$1.14 33.27,28.36 v33.27,29.72 | v52.83,43.69 53.34,44.2 v59.18,44.2
  Bottom 0.406: POWER3.3V.-V 32.8,52.91 C16.- | C16.- 35,52.02 PROG.6 | C13.1 C12.1 31.87,42.2 C11.1 | C15.2 31.83,52.02 C16.-
  other vias: 39.37,33.02 39.37,30.48 41.66,31.75 39.12,22.86 38.86,16.51 30.73,21.59 33.02,36.32 27.18,53.34 53.34,55.12 61.47,44.7 56.39,12.45 58.42,2.29 52.58,2.79 48.01,43.69 39.62,46.48 57.4,42.67 59.18,55.12 46.23,21.08 46.99,16.26
  pour Top (isolate 0.254): 60.96,0 39.12,0 39.12,15.24 34.8,15.24 29.72,20.32 29.72,39.88 28.7,39.88 25.65,42.93 25.65,56.9 60.96,56.9 60.96,47.5 62.23,47.5 62.23,9.4 60.96,9.4
  pour Bottom (isolate 0.254): 25.65,56.9 60.96,56.9 60.96,47.5 62.23,47.5 62.23,9.4 60.96,9.4 60.96,0 39.12,0 39.12,15.24 34.8,15.24 29.72,20.32 29.72,39.88 28.7,39.88 25.65,42.93
IO0  (via drill 0.35)
  Top 0.254: R9.2 44.74,16.82 ESP32.25 44.74,21.88 45.47,22.61 45.47,29.21 v48.77,32.51 | v50.55,46.74 50.55,48.08 Q2.2
  Bottom 0.254: v48.77,32.51 48.77,35.81 50.29,37.34 50.29,46.48 v50.55,46.74
IO2
  Top 0.254: ESP32.24 43.47,16.82 R12.2
IO32  (via drill 0.35)
  Top 0.254: C23.1 52.73,40.65 Y2.1 52.36,38.55 ESP32.8 52.36,35.7 v52.81,35.26
  Bottom 0.254: R14.2 56.44,35.96 55.83,35.36 | 55.83,35.36 55.75,35.28 55.75,33.29 RTC.4 | 55.83,35.36 55.35,35.36 54.84,35.87 53.42,35.87 v52.81,35.26
IO33
  Top 0.254: C26.1 Y2.2 51.09,38.78 ESP32.9
MISO  (via drill 0.35)
  Top 0.254: ESP32.31 52.32,19.04 v52.32,16.76 52.69,16.4 C4.2
  Bottom 0.254: U$1.24 44.29,24.8 v52.32,16.76 53.3,15.79 R6.1
MOSI  (via drill 0.35)
  Top 0.254: ESP32.37 59.94,19.04 v59.94,17.02 59.94,15.37 C5.2
  Bottom 0.254: U$1.23 45.06,25.3 53.34,17.02 v59.94,17.02 59.94,15.82 R7.1
N$1
  Top 0.254: R2.1 44.21,47.71 Q1.1
N$2
  Top 0.254: R3.1 47.36,49.17 Q2.1
N$3  (via drill 0.35)
  Top 0.254: v36.58,30.73 35.56,31.75 35.56,44.2 37.88,46.51 C8.2
  Top 0.406: C10.2 37.7,49.94 38.1,49.53 38.1,48.88 C9.2 38.08,47.51 C8.2
  Bottom 0.254: U$1.19 36.95,27.3 37.34,27.69 37.34,29.97 v36.58,30.73
N$4
  Bottom 2.54: RELAY.4 RELAY.14 18.73,11.75 17.78,12.7 6.33,12.7 N_OUT.A2 N_OUT.A1
N$6
  Bottom 0.254: U$1.15 33.99,38.37 33.6,38.77
  Bottom 0.406: 33.6,38.77 C13.2 C12.2 33.35,41.03 C11.2
N$7
  Bottom 0.254: R18.2 33.55,18.51 Y1.3 33.55,22.12 34.49,23.06 U$1.3
N$8
  Bottom 0.254: R18.1 35.95,18.56 Y1.1 36.12,20.53 35.94,20.7 35.94,22.1 34.99,23.05 U$1.2
N$9
  Bottom 0.254: R20.2 C24.1 27.19,24.83 29.16,26.8 U$1.11
N$10
  Bottom 0.254: U$1.20 39.32,26.8 R11.1
N$11
  Bottom 0.254: U$1.10 30.11,26.3 26.94,23.13 C24.2 26.34,22.79 R19.2
N$12
  Top 0.254: Q3.1 49.68,8.75 R26.1
N$13  (via drill 0.35)
  Top 0.254: v24.38,27.43 27.18,27.43 v29.97,24.64
  Bottom 0.254: U$1.8 30.63,25.3 v29.97,24.64 | R21.2 28.22,31.3 R22.1 24.39,31.25 24.39,31.05 24.29,31.17 C25.2 24.29,27.52 v24.38,27.43
N$14
  Bottom 0.254: R24.1 R23.2
N$15
  Bottom 0.254: R23.1 24.49,34.14 R22.2
N$16
  Top 0.254: R31.2 ERROR.A
N$17
  Top 0.254: RELAY.A1 47.57,10.95 Q3.3
  Top 0.406: 44.05,10.92 RELAY.A1
  Bottom 0.406: D1.A 44.3,11.18 RELAY.A1
N$19
  Bottom 0.254: L3.1 16.5,36.95 R24.2
N$21
  Bottom 0.254: R19.1 L1.2
N$22
  Bottom 0.254: L2.2 22.61,24.75 22.76,24.75 R20.1
N$24
  Bottom 0.254: SHUNT.SEN2 18.11,21.87 19.03,22.79 L1.1
N$25
  Bottom 0.254: SHUNT.SEN1 16.91,22.63 19.04,24.75 L2.1
N$27  (via drill 0.35)
  Top 0.254: v49.78,1.39 49.67,1.51 Q4.1
  Bottom 0.254: R27.1 49.52,1.66 v49.78,1.39
N$28
  Top 0.254: RELAY.A2 47.63,3.45 Q4.3
  Bottom 0.406: 46.47,3.3 D2.A 44.22,3.3 RELAY.A2
RELAY_RESET  (via drill 0.35)
  Top 0.254: R26.2 46.04,8.57 45.72,8.89 v41.66,8.89 | v43.18,23.62 43.18,29.97 47.28,34.08 ESP32.12
  Bottom 0.254: R5.1 43.17,12.45 41.67,10.95 41.67,8.9 v41.66,8.89 41.66,20.07 43.18,21.59 v43.18,23.62
RELAY_SET  (via drill 0.35)
  Top 0.254: R4.1 47.43,5.08 v41.66,5.08 | ESP32.11 48.55,33.82 44.45,29.72 44.45,22.86 42.84,21.25 v40.98,21.25
  Bottom 0.254: R27.2 42.75,1.66 41.66,2.75 v41.66,5.08 40.64,6.1 40.64,20.91 v40.98,21.25
RTS
  Top 0.254: Q1.2 46.06,49.23 R3.2 44.67,46.23 41.66,46.23 39.88,48.01 PROG.5
RX  (via drill 0.35)
  Top 0.254: ESP32.34 56.13,19.12 56.13,20.57 52.32,24.38 50.04,24.38 46.99,27.43 v46.99,28.96
  Bottom 0.254: v46.99,28.96 46.99,35.81 45.97,36.83 45.47,36.83 44.45,37.85 44.45,53.85 PROG.3
SCK  (via drill 0.35)
  Top 0.254: v51.05,20.57 51.09,20.53 ESP32.30 51.05,19.04 v51.05,16.76 51.23,16.58 C3.2
  Bottom 0.254: U$1.22 45.83,25.8 v51.05,20.57 | R8.1 50.92,16.63 v51.05,16.76
SCL  (via drill 0.35)
  Top 0.254: R15.1 58.42,17.78 58.71,18.07 ESP32.36 58.67,19.12 v58.67,20.57
  Bottom 0.254: RTC.16 51.98,21.68 54.1,19.56 57.66,19.56 v58.67,20.57
SDA  (via drill 0.35)
  Top 0.254: R25.1 54.86,19.04 ESP32.33 54.9,20.28 v54.61,20.57
  Bottom 0.254: v54.61,20.57 53.24,21.94 RTC.15
STPM_CS  (via drill 0.35)
  Top 0.254: v49.78,23.11 49.78,19.12 ESP32.29 49.82,15.4 C6.2
  Bottom 0.254: U$1.21 46.6,26.3 v49.78,23.11
STPM_EN
  Top 0.254: R16.2 44.69,41.2 R17.2 44.74,39.12 ESP32.14
STPM_SYN  (via drill 0.35)
  Top 0.254: v45.97,35.05 46.01,35.09 ESP32.13 46.01,38.31 v45.97,38.35 46.55,38.93 C7.2
  Bottom 0.254: R10.1 46.04,38.42 v45.97,38.35 | R11.2 43.52,27.56 C2.2 43.53,32.61 v45.97,35.05
TX  (via drill 0.35)
  Top 0.254: ESP32.35 57.44,20.28 52.58,25.15 50.29,25.15 48.01,27.43 v48.01,29.72
  Bottom 0.254: v48.01,29.72 47.75,29.97 47.75,35.81 49.78,37.85 49.78,50.55 47.5,52.83 PROG.2

### Text on the board
tNames: -